# Altium schematic sheet Mis - Voltage Regulators 500m SMD.SchDoc
size Letter
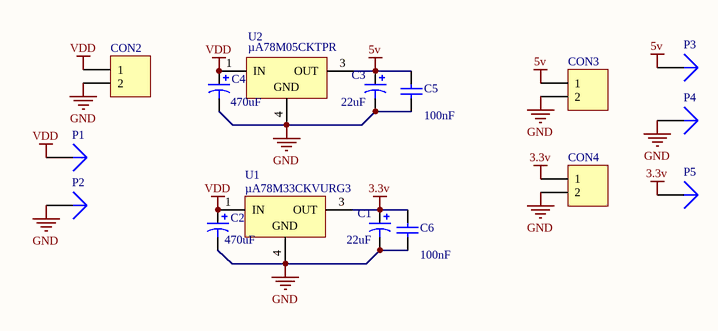
[diagram p0: Mis - Voltage Regulators 500m SMD.SchDoc]

## Parts
C1  value 22uF  [C-4x4]  (hidden comment: Cap Pol2)
C2  value 470uF  [C-10x10]  (hidden comment: Cap Pol2)
C3  value 22uF  [C-4x4]  (hidden comment: Cap Pol2)
C4  value 470uF  [C-10x10]  (hidden comment: Cap Pol2)
C5  value 100nF  [4532[1812]]  (hidden comment: Cap)
C6  value 100nF  [4532[1812]]  (hidden comment: Cap)
CON2  Header 2  [HDR1X2]  (value not drawn)
CON3  Header 2  [HDR1X2]  (value not drawn)
CON4  Header 2  [HDR1X2]  (value not drawn)
P1  Plug  [PIN1]  (value not drawn)
P2  Plug  [PIN1]  (value not drawn)
P3  Plug  [PIN1]  (value not drawn)
P4  Plug  [PIN1]  (value not drawn)
P5  Plug  [PIN1]  (value not drawn)
U1  µA78M33CKVURG3  [KTP02]
U2  µA78M05CKTPR  [KTP02]

## Nets
3.3v: C1.1 C6.2 CON4.1 P5.1 U1.3(OUT)
5v: C3.1 C5.2 CON3.1 P3.1 U2.3(OUT)
GND: C1.2 C2.2 C3.2 C4.2 C5.1 C6.1 CON2.2 CON3.2 CON4.2 P2.1 P4.1 U1.4(GND) U2.4(GND)
VDD: C2.1 C4.1 CON2.1 P1.1 U1.1(IN) U2.1(IN)

## Library data of the parts
C1-C4 = Cap Pol2: Polarized Capacitor (Axial); Published: 8-Jun-2000; LatestRevisionDate: 17-Jul-2002; LatestRevisionNote: Re-released for DXP Platform.; PackageReference: POLAR0.8; Publisher: Altium Limited; PackageDescription: Polarized Capacitor; 2 Leads
C5 C6 = Cap: Capacitor; Published: 8-Jun-2000; LatestRevisionDate: 17-Jul-2002; LatestRevisionNote: Re-released for DXP Platform.; PackageReference: RAD-0.3; Publisher: Altium Limited; PackageDescription: Radial Cap, Thru-Hole; 2 Leads; 0.3 in Pin Spacing
CON2-CON4 = Header 2: Header, 2-Pin; LatestRevisionDate: 17-Jul-2002; LatestRevisionNote: Re-released for DXP Platform.; Publisher: Altium Limited
U1 = µA78M33CKVURG3: Positive-Voltage Regulator
U2 = µA78M05CKTPR: Positive-Voltage Regulator; Note: Pin 2 is electrically connected to pin4, and not drawn.; Published: 15-Apr-2002; DatasheetVersion: Jul-1999; PackageVersion: Jan-2001; PackageReference: KTP02; Publisher: Altium Limited; PackageDescription: PowerFLEX (D-PAK/TO-252-AA); 3 Leads (1 Cropped); Body 9.7 (inc. leads) x 6.2 mm (LxW max); Code_JEDEC: TO-252; ComponentLink1Description: Manufacturer Link; ComponentLink1URL: http://www.ti.com/; ComponentLink2Description: Datasheet; ComponentLink2URL: http://www-s.ti.com/sc/ds/ua78m05.pdf
P1-P5 = Plug: LatestRevisionDate: 17-Jul-2002; LatestRevisionNote: Re-released for DXP Platform.; Publisher: Altium Limited